# EAGLE schematic LPC_1TE_3.42 (EAGLE 5.10)
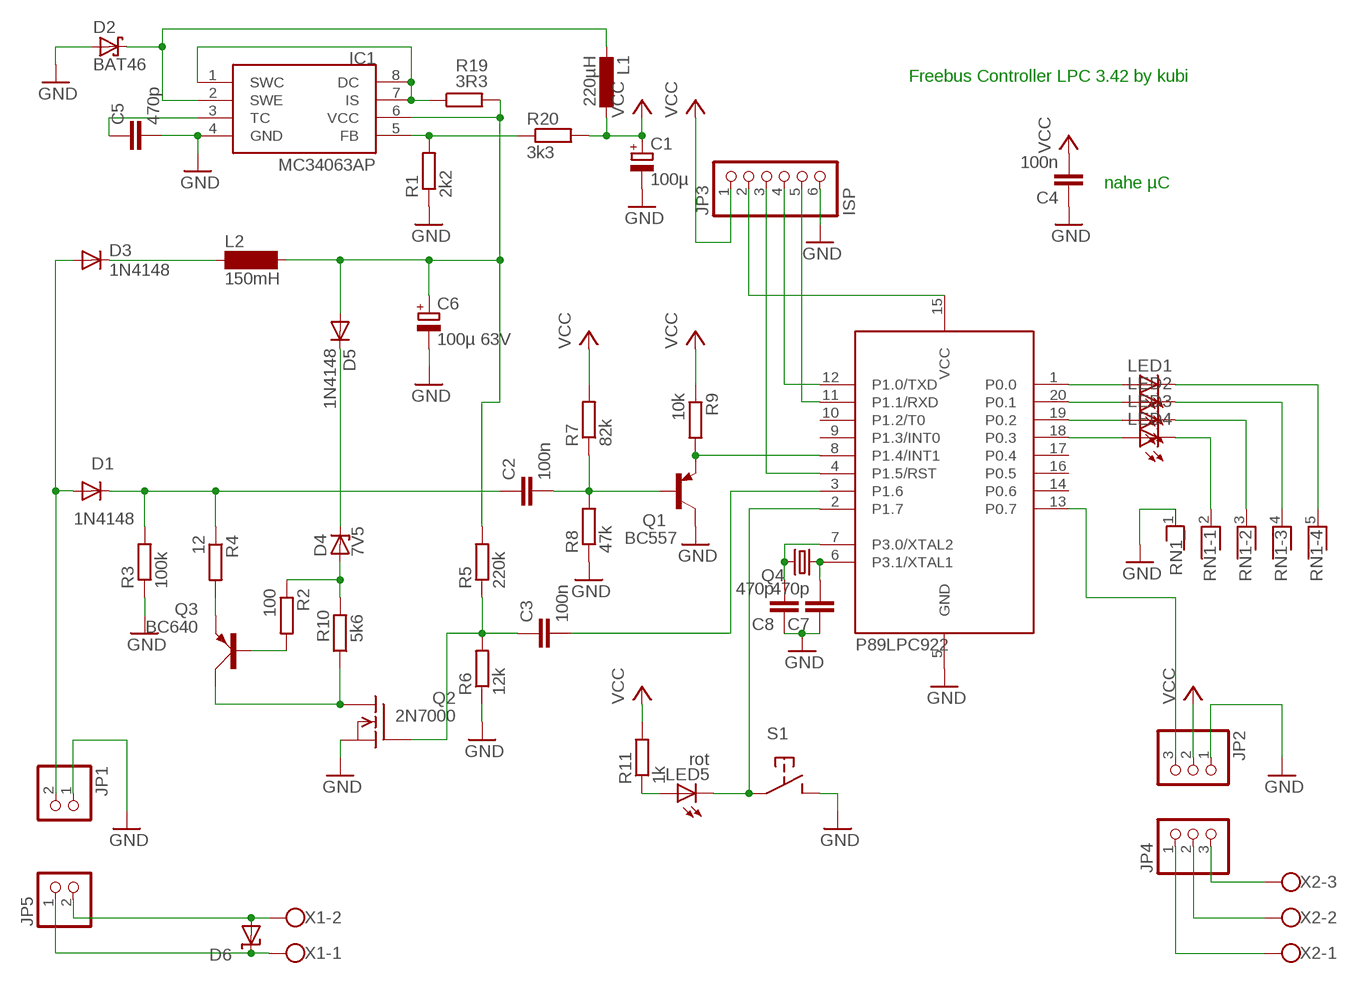
[diagram p0: schematic, sheet 1]

## Parts
C1  100µ  CPOL-EUE5-8.5  [E5-8,5]
C2  100n  C-EU050-024X044  [C050-024X044]
C3  100n  C-EU050-024X044  [C050-024X044]
C4  100n  C-EU050-024X044  [C050-024X044]
C5  470p  C-EU025-024X044  [C025-024X044]
C6  100µ 63V  CPOL-EUE5-10.5  [E5-10,5]
C7  470p  C-EU025-024X044  [C025-024X044]
C8  470p  C-EU025-024X044  [C025-024X044]
D1  1N4148  [DO35-10]
D2  BAT46  BAT49  [DO41-10]
D3  1N4148  [DO35-10]
D4  7V5  ZPD  [DO35Z10]
D5  1N4148  [DO35-10]
D6  SUPPRESSOR-SMBJ  [SMBJ]
IC1  MC34063AP  [DIL08]
JP1  PINHD-1X2  [1X02]
JP2  PINHD-1X3  [1X03]
JP3  ISP  PINHD-1X6  [1X06]
JP4  PINHD-1X3  [1X03]
JP5  PINHD-1X2  [1X02]
L1  220µH  L-EU2200-12.7  [2200-12.7]
L2  150mH  SD12K100  [SD12K100]
LED1  LED3MM  [LED3MM]
LED2  LED3MM  [LED3MM]
LED3  LED3MM  [LED3MM]
LED4  LED3MM  [LED3MM]
LED5  rot  LED3MM  [LED3MM]
Q1  BC557  [TO92]
Q2  2N7000  VN2222KM  [TO237]
Q3  BC640  [SOT54D]
Q4  CRYSTALHC49U-V  [HC49U-V]
R1  2k2  R-EU_0207/10  [0207/10]
R2  100  R-EU_0207/10  [0207/10]
R3  100k  R-EU_0207/10  [0207/10]
R4  12  R-EU_0207/10  [0207/10]
R5  220k  R-EU_0207/10  [0207/10]
R6  12k  R-EU_0207/10  [0207/10]
R7  82k  R-EU_0207/10  [0207/10]
R8  47k  R-EU_0207/10  [0207/10]
R9  10k  R-EU_0207/10  [0207/10]
R10  5k6  R-EU_0207/10  [0207/10]
R11  1k  R-EU_0207/10  [0207/10]
R19  3R3  R-EU_0207/10  [0207/10]
R20  3k3  R-EU_0207/10  [0207/10]
RN1  RNX4  [RN-5]
S1  3305  [3305]
U1  89LPC922  [DIL20]
X1  W237-02P  [W237-132]
X2  W237-03P  [W237-133]

## Nets
GND: C1.- C4.1 C5.2 C6.- C7.1 C8.1 D2.A IC1.4(GND) JP1.1 JP2.1 JP3.6 Q1.3(C) Q2.3(S) R1.1 R3.1 R6.1 R8.1 RN1.1 S1.P$2 U1.5(GND)
N$1: Q1.1(E) R9.2 U1.8(P1.4/INT1)
N$2: C2.2 Q1.2(B) R7.1 R8.2
N$3: IC1.5(FB) R1.2 R20.1
N$4: IC1.1(SWC) IC1.7(IS) IC1.8(DC) R19.1
N$5: C3.2 U1.3(P1.6)
N$6: Q2.1(D) Q3.C R10.1
N$7: C6.+ D5.A IC1.6(VCC) L2.2 R5.2 R19.2
N$8: D3.C L2.1
N$9: C2.1 D1.C R3.2 R4.1
N$10: D2.C IC1.2(SWE) L1.2
N$11: D4.A R2.1 R10.2
N$12: Q3.E R4.2
N$13: C5.1 IC1.3(TC)
N$14: Q3.B R2.2
N$15: LED5.K(C) S1.P$1 U1.2(P1.7)
N$16: D1.A D3.A JP1.2
N$17: D6.A JP5.2 X1.2
N$18: D6.C JP5.1 X1.1
N$19: JP4.3 X2.3
N$20: LED1.A U1.1(P0.0)
N$21: LED2.A U1.20(P0.1)
N$22: LED3.A U1.19(P0.2)
N$23: LED4.A U1.18(P0.3)
N$24: C7.2 Q4.1 U1.6(P3.1/XTAL1)
N$25: C8.2 Q4.2 U1.7(P3.0/XTAL2)
N$26: JP4.2 X2.2
N$27: JP4.1 X2.1
N$28: JP2.3 U1.13(P0.7)
N$29: JP3.4 U1.12(P1.0/TXD)
N$30: JP3.5 U1.11(P1.1/RXD)
N$31: JP3.3 U1.4(P1.5/RST)
N$32: JP3.2 U1.15(VCC)
N$34: C3.1 Q2.2(G) R5.1 R6.2
N$37: LED4.K(C) RN1.2
N$38: LED3.K(C) RN1.3
N$39: LED2.K(C) RN1.4
N$40: D4.C D5.C
N$41: LED5.A R11.1
N$42: LED1.K(C) RN1.5
VCC: C1.+ C4.2 JP2.2 JP3.1 L1.1 R7.2 R9.1 R11.2 R20.2
Unconnected: U1.9(P1.3/INT0) U1.10(P1.2/T0) U1.14(P0.6) U1.16(P0.5) U1.17(P0.4)

## Notes on the sheet
- Freebus Controller LPC 3.42 by kubi
- nahe µC
- P89LPC922

## Library data of the parts
C1 C6 = rcl:CPOL-EU: POLARIZED CAPACITOR, European symbol
C2-C5 C7 C8 = rcl:C-EU: CAPACITOR, European symbol
D1 D3 D5 = diode:1N4148: DIODE high speed (Philips)
D2 = diode:BAT49: DIODE small signal diode
D4 = diode:ZPD: Z DIODE 500 mW
D6 = diode:SUPPRESSOR-: Suppressor diode
IC1 = mc34063:MC34063
JP1 JP5 = pinhead:PINHD-1X2: PIN HEADER
JP2 JP4 = pinhead:PINHD-1X3: PIN HEADER
JP3 = pinhead:PINHD-1X6: PIN HEADER
L1 = rcl:L-EU: INDUCTOR, European symbol
L2 = inductor-neosid:SD12: INDUCTOR nominal inductance
LED1-LED5 = led:LED: LED OSRAM: - CHIPLED LG R971, LG N971, LY N971, LG Q971, LY Q971, LO R971, LY R971 LH N974, LH R974 LS Q976, LO Q976, LY Q976 LO Q996 - Hyper CHIPLED LW Q18S LB Q993, LB Q99A, LB R99A - SideLED LS A670, LO A670, LY A670, LG A670, LP A670 LB A673, LV A673, LT A673, LW A673 LH A674 LY A675 LS A676, LA A676, LO A676, LY A676, LW A676 LS A679, LY A679, LG A679 - Hyper Micro SIDELED® LS Y876, LA Y876, LO Y876, LY Y876 LT Y87S - SmartLED LW L88C, LW L88S LB L89C, LB L89S, LG L890 LS L89K, LO L89K, LY L89K LS L896, LA L896, LO L896, LY L896 - TOPLED LS T670, LO T670, LY T670, LG T670, LP T670 LSG T670, LSP T670, LSY T670, LOP T670, LYG T670 LG T671, LOG T671, LSG T671 LB T673, LV T673, LT T673, LW T673 LH T674 LS T676, LA T676, LO T676, LY T676, LB T676, LH T676, LSB T676, LW T676 LB T67C, LV T67C, LT T67C, LS T67K, LO T67K, LY T67K, LW E67C LS E67B, LA E67B, LO E67B, LY E67B, LB E67C, LV E67C, LT E67C LW T67C LS T679, LY T679, LG T679 LS T770, LO T770, LY T770, LG T770, LP T770 LB T773, LV T773, LT T773, LW T773 LH T774 LS E675, LA E675, LY E675, LS T675 LS T776, LA T776, LO T776, LY T776, LB T776 LHGB T686 LT T68C, LB T68C - Hyper Mini TOPLED® LB M676 - Mini TOPLED Santana® LG M470 LS M47K, LO M47K, LY M47K Source: http://www.osram.convergy.de - LUMILED® LXK2-PW12-R00, LXK2-PW12-S00, LXK2-PW14-U00, LXK2-PW14-V00 LXK2-PM12-R00, LXK2-PM12-S00, LXK2-PM14-U00 LXK2-PE12-Q00, LXK2-PE12-R00, LXK2-PE12-S00, LXK2-PE14-T00, LXK2-PE14-U00 LXK2-PB12-K00, LXK2-PB12-L00, LXK2-PB12-M00, LXK2-PB14-N00, LXK2-PB14-P00, LXK2-PB14-Q00 LXK2-PR12-L00, LXK2-PR12-M00, LXK2-PR14-Q00, LXK2-PR14-R00 LXK2-PD12-Q00, LXK2-PD12-R00, LXK2-PD12-S00 LXK2-PH12-R00, LXK2-PH12-S00 LXK2-PL12-P00, LXK2-PL12-Q00, LXK2-PL12-R00 Source: www.luxeon.com
Q1 = transistor-pnp:BC557: PNP Transistor
Q2 = transistor-fet:VN2222KM: N-Channel Enhancement MOSFET (VMOS); 60V; 0,5A; 7,5Ohm
Q3 = transistor-small-signal:BC640: PNP TRANSISTOR
Q4 = crystal:CRYSTAL: CRYSTAL
R1-R11 R19 R20 = rcl:R-EU_: RESISTOR, European symbol
RN1 = resistor-net:RNX4: RESISTOR NETWORK
S1 = kubi:3305: Taster 3305
U1 = micro-philips:89LPC922
X1 = con-wago-508:W237-02P: WAGO SREW CLAMP
X2 = con-wago-508:W237-03P: WAGO SREW CLAMP